# EAGLE schematic MonoMixer (EAGLE 7.5.0)
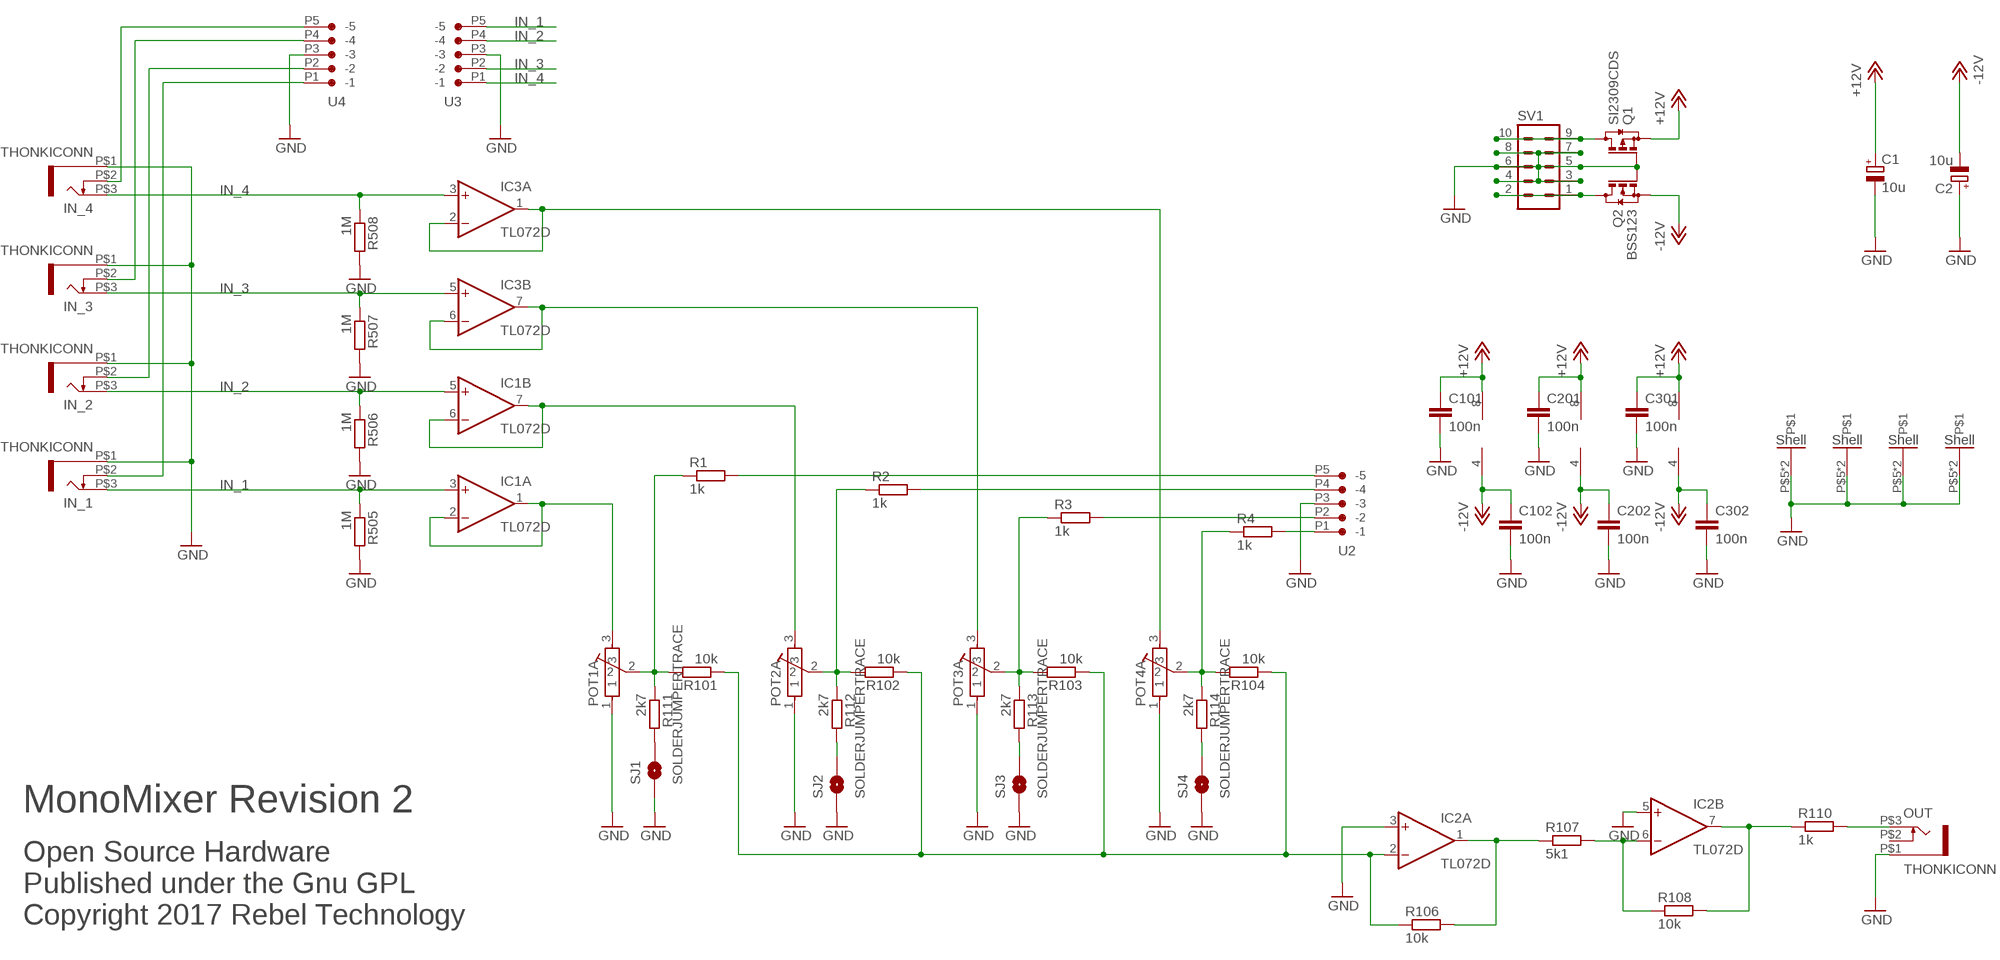
[diagram p0: schematic, sheet 1]

## Parts
C1  10u  CPOL-EU153CLV-0505  [153CLV-0505]
C2  10u  CPOL-EU153CLV-0505  [153CLV-0505]
C101  100n  C-EUC0603  [C0603]
C102  100n  C-EUC0603  [C0603]
C201  100n  C-EUC0603  [C0603]
C202  100n  C-EUC0603  [C0603]
C301  100n  C-EUC0603  [C0603]
C302  100n  C-EUC0603  [C0603]
IC1  TL072D  [SO08]
IC2  TL072D  [SO08]
IC3  TL072D  [SO08]
IN_1  THONKICONN  [THONKICONN]
IN_2  THONKICONN  [THONKICONN]
IN_3  THONKICONN  [THONKICONN]
IN_4  THONKICONN  [THONKICONN]
OUT  THONKICONN  [THONKICONN]
POT1A  POT-ALPS-RK09L1140  [POT-ALPS-RK09L1140]
POT2A  POT-ALPS-RK09L1140  [POT-ALPS-RK09L1140]
POT3A  POT-ALPS-RK09L1140  [POT-ALPS-RK09L1140]
POT4A  POT-ALPS-RK09L1140  [POT-ALPS-RK09L1140]
Q1  SI2309CDS  BSS84  [SOT23]
Q2  BSS123  [SOT23]
R1  1k  R-EU_R0603  [R0603]
R2  1k  R-EU_R0603  [R0603]
R3  1k  R-EU_R0603  [R0603]
R4  1k  R-EU_R0603  [R0603]
R101  10k  R-EU_R0603  [R0603]
R102  10k  R-EU_R0603  [R0603]
R103  10k  R-EU_R0603  [R0603]
R104  10k  R-EU_R0603  [R0603]
R106  10k  R-EU_R0603  [R0603]
R107  5k1  R-EU_R0603  [R0603]
R108  10k  R-EU_R0603  [R0603]
R110  1k  R-EU_R0603  [R0603]
R111  2k7  R-EU_R0603  [R0603]
R112  2k7  R-EU_R0603  [R0603]
R113  2k7  R-EU_R0603  [R0603]
R114  2k7  R-EU_R0603  [R0603]
R505  1M  R-EU_R0603  [R0603]
R506  1M  R-EU_R0603  [R0603]
R507  1M  R-EU_R0603  [R0603]
R508  1M  R-EU_R0603  [R0603]
SJ1  SOLDERJUMPERTRACE  [SJ_2S-TRACE]
SJ2  SOLDERJUMPERTRACE  [SJ_2S-TRACE]
SJ3  SOLDERJUMPERTRACE  [SJ_2S-TRACE]
SJ4  SOLDERJUMPERTRACE  [SJ_2S-TRACE]
SV1  MA05-2  [MA05-2]
U2  CON-JST_PH_5W  [CON-JST_PH_5W]
U3  CON-JST_PH_5W  [CON-JST_PH_5W]
U4  CON-JST_PH_5W  [CON-JST_PH_5W]

## Nets
+12V: C1.+ C101.1 C201.1 C301.1 IC1.8(P:V+) IC2.8(P:V+) IC3.8(P:V+) Q1.2(S)
-12V: C2.- C102.1 C202.1 C302.1 IC1.4(P:V-) IC2.4(P:V-) IC3.4(P:V-) Q2.2(S)
GND: C1.- C2.+ C101.2 C102.2 C201.2 C202.2 C301.2 C302.2 IC2.3(A:+IN) IC2.5(B:+IN) IN_1.P$1 IN_2.P$1 IN_3.P$1 IN_4.P$1 OUT.P$1 POT1A.1 POT1A.P$5 POT1A.P$6 POT2A.1 POT2A.P$5 POT2A.P$6 POT3A.1 POT3A.P$5 POT3A.P$6 POT4A.1 POT4A.P$5 POT4A.P$6 Q1.1(G) Q2.1(G) R505.2 R506.2 R507.2 R508.2 SJ1.1 SJ2.1 SJ3.1 SJ4.1 SV1.3 SV1.4 SV1.5 SV1.6 SV1.7 SV1.8 U2.P3(-3) U3.P3(-3) U4.P3(-3)
IN_1: IC1.3(A:+IN) IN_1.P$3 R505.1 U3.P5(-5)
IN_2: IC1.5(B:+IN) IN_2.P$3 R506.1 U3.P4(-4)
IN_3: IC3.5(B:+IN) IN_3.P$3 R507.1 U3.P2(-2)
IN_4: IC3.3(A:+IN) IN_4.P$3 R508.1 U3.P1(-1)
IN_SW_1: IN_1.P$2 U4.P1(-1)
IN_SW_2: IN_2.P$2 U4.P2(-2)
IN_SW_3: IN_3.P$2 U4.P4(-4)
IN_SW_4: IN_4.P$2 U4.P5(-5)
N$1: Q2.3(D) SV1.1 SV1.2
N$2: R1.2 U2.P5(-5)
N$3: R2.2 U2.P4(-4)
N$4: R3.2 U2.P2(-2)
N$5: R4.2 U2.P1(-1)
N$6: IC2.7(B:OUT) R108.2 R110.1
N$9: OUT.P$3 R110.2
N$11: IC2.2(A:-IN) R101.1 R102.1 R103.1 R104.1 R106.1
N$13: IC2.1(A:OUT) R106.2 R107.1
N$14: Q1.3(D) SV1.9 SV1.10
N$17: R111.2 SJ1.2
N$18: IC2.6(B:-IN) R107.2 R108.1
N$22: R112.2 SJ2.2
N$24: R113.2 SJ3.2
N$25: R114.2 SJ4.2
N$29: POT1A.2 R1.1 R101.2 R111.1
N$35: IC3.1(A:OUT) IC3.2(A:-IN) POT4A.3
N$36: IC3.6(B:-IN) IC3.7(B:OUT) POT3A.3
N$37: IC1.6(B:-IN) IC1.7(B:OUT) POT2A.3
N$38: IC1.1(A:OUT) IC1.2(A:-IN) POT1A.3
N$47: POT4A.2 R4.1 R104.2 R114.1
N$49: POT3A.2 R3.1 R103.2 R113.1
N$51: POT2A.2 R2.1 R102.2 R112.1
Unconnected: OUT.P$2

## Notes on the sheet
- MonoMixer Revision 2
- Open Source Hardware
  Published under the Gnu GPL
  Copyright 2017 Rebel Technology

## Library data of the parts
C1 C2 = rcl:CPOL-EU: POLARIZED CAPACITOR, European symbol
C101 C102 C201 C202 C301 C302 = resistor:C-EU: CAPACITOR, European symbol
IC1-IC3 = linear:TL072: OP AMP
IN_1-IN_4 OUT = Rebel:THONKICONN
POT1A POT2A POT3A POT4A = Rebel:POT-ALPS-RK09L
Q1 = transistor-small-signal:BSS84: P-CHANNEL MOS FET
Q2 = transistor-small-signal:BSS123: N-CHANNEL MOS FET
R1-R4 R101-R104 R106-R108 R110-R114 R505-R508 = resistor:R-EU_: RESISTOR, European symbol
SJ1-SJ4 = SparkFun:SOLDERJUMPER: Solder Jumper Standard SMD solder jumper. Used to automate production. Two varients : Normally Open and Normally Closed are the same, but have different paste layers. NC will have a large amount of paste and should jumper during reflow.
SV1 = con-lstb:MA05-2: PIN HEADER; OC_FARNELL: unknown; OC_NEWARK: unknown
U2-U4 = Rebel:CON-JST_PH_5W